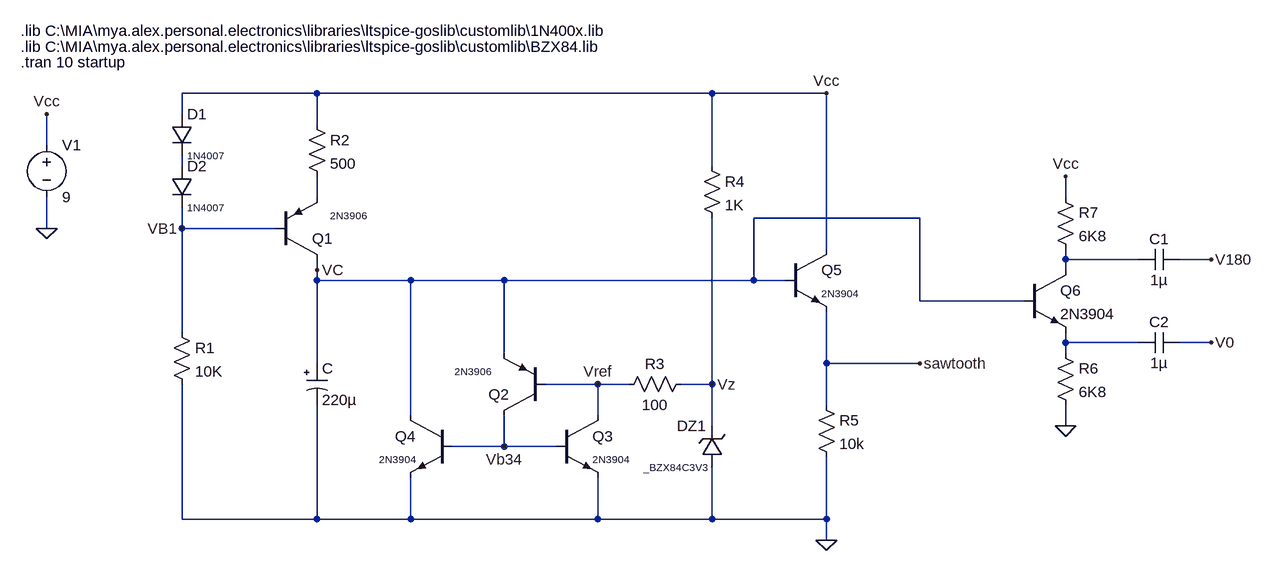
[diagram p0: schematic bjt-sawtooth-wave-generator.asc]
bjt-sawtooth-wave-generator.asc, the LTspice schematic file:
Version 4
SHEET 1 1076 740
WIRE -1648 -64 -1856 -64
WIRE -1040 -64 -1648 -64
WIRE -864 -64 -1040 -64
WIRE -1856 -32 -1856 -64
WIRE -1648 -16 -1648 -64
WIRE -2064 16 -2064 -32
WIRE -1856 48 -1856 32
WIRE -1040 48 -1040 -64
WIRE -1648 96 -1648 64
WIRE -496 96 -496 64
WIRE -720 128 -976 128
WIRE -2064 144 -2064 96
WIRE -1856 144 -1856 112
WIRE -1712 144 -1856 144
WIRE -864 176 -864 -64
WIRE -496 192 -496 176
WIRE -384 192 -496 192
WIRE -272 192 -320 192
WIRE -1648 208 -1648 192
WIRE -496 208 -496 192
WIRE -1648 224 -1648 208
WIRE -1504 224 -1648 224
WIRE -1360 224 -1504 224
WIRE -976 224 -976 128
WIRE -976 224 -1360 224
WIRE -928 224 -976 224
WIRE -720 256 -720 128
WIRE -560 256 -720 256
WIRE -1856 304 -1856 144
WIRE -496 320 -496 304
WIRE -384 320 -496 320
WIRE -272 320 -320 320
WIRE -1360 336 -1360 224
WIRE -496 336 -496 320
WIRE -1648 352 -1648 224
WIRE -864 352 -864 272
WIRE -720 352 -864 352
WIRE -1216 384 -1296 384
WIRE -1168 384 -1216 384
WIRE -1040 384 -1040 128
WIRE -1040 384 -1088 384
WIRE -864 416 -864 352
WIRE -1504 432 -1504 224
WIRE -1216 432 -1216 384
WIRE -1040 448 -1040 384
WIRE -496 448 -496 416
WIRE -1360 480 -1360 432
WIRE -1360 480 -1440 480
WIRE -1280 480 -1360 480
WIRE -1856 592 -1856 384
WIRE -1648 592 -1648 416
WIRE -1648 592 -1856 592
WIRE -1504 592 -1504 528
WIRE -1504 592 -1648 592
WIRE -1216 592 -1216 528
WIRE -1216 592 -1504 592
WIRE -1040 592 -1040 512
WIRE -1040 592 -1216 592
WIRE -864 592 -864 496
WIRE -864 592 -1040 592
WIRE -864 624 -864 592
FLAG -2064 144 0
FLAG -1856 144 VB1
FLAG -2064 -32 Vcc
FLAG -1648 208 VC
FLAG -1360 480 Vb34
FLAG -864 -64 Vcc
FLAG -864 624 0
FLAG -720 352 sawtooth
FLAG -1040 384 Vz
FLAG -1216 384 Vref
FLAG -496 448 0
FLAG -272 192 V180
FLAG -272 320 V0
FLAG -496 64 Vcc
SYMBOL voltage -2064 0 R0
WINDOW 123 0 0 Left 0
WINDOW 39 0 0 Left 0
SYMATTR InstName V1
SYMATTR Value 9
SYMBOL pnp -1712 192 M180
WINDOW 3 84 68 Left 1
SYMATTR Value 2N3906
SYMATTR InstName Q1
SYMBOL res -1664 -32 R0
SYMATTR InstName R2
SYMATTR Value 500
SYMBOL polcap -1664 352 R0
WINDOW 3 24 56 Left 2
SYMATTR Value 220µ
SYMATTR InstName C
SYMATTR Description Capacitor
SYMATTR Type cap
SYMBOL res -1872 288 R0
SYMATTR InstName R1
SYMATTR Value 10K
SYMBOL diode -1872 48 R0
WINDOW 3 24 64 Left 1
SYMATTR Value 1N4007
SYMATTR InstName D2
SYMBOL diode -1872 -32 R0
WINDOW 3 24 64 Left 1
SYMATTR Value 1N4007
SYMATTR InstName D1
SYMBOL zener -1024 512 R180
WINDOW 0 24 64 Left 2
WINDOW 3 24 0 Left 1
SYMATTR InstName DZ1
SYMATTR Value _BZX84C3V3
SYMBOL res -1056 32 R0
SYMATTR InstName R4
SYMATTR Value 1K
SYMBOL npn -1280 432 R0
WINDOW 3 56 68 Left 1
SYMATTR Value 2N3904
SYMATTR InstName Q3
SYMBOL pnp -1296 432 R180
WINDOW 3 84 68 Left 1
SYMATTR Value 2N3906
SYMATTR InstName Q2
SYMBOL npn -1440 432 M0
WINDOW 3 56 68 Left 1
SYMATTR Value 2N3904
SYMATTR InstName Q4
SYMBOL res -1072 368 R90
WINDOW 0 0 56 VBottom 2
WINDOW 3 32 56 VTop 2
SYMATTR InstName R3
SYMATTR Value 100
SYMBOL res -880 400 R0
SYMATTR InstName R5
SYMATTR Value 10k
SYMBOL npn -928 176 R0
WINDOW 3 56 68 Left 1
SYMATTR Value 2N3904
SYMATTR InstName Q5
SYMBOL npn -560 208 R0
SYMATTR InstName Q6
SYMATTR Value 2N3904
SYMBOL res -512 320 R0
SYMATTR InstName R6
SYMATTR Value 6K8
SYMBOL res -512 80 R0
SYMATTR InstName R7
SYMATTR Value 6K8
SYMBOL cap -320 176 R90
WINDOW 0 0 32 VBottom 2
WINDOW 3 32 32 VTop 2
SYMATTR InstName C1
SYMATTR Value 1µ
SYMBOL cap -320 304 R90
WINDOW 0 0 32 VBottom 2
WINDOW 3 32 32 VTop 2
SYMATTR InstName C2
SYMATTR Value 1µ
TEXT -2104 -112 Left 2 !.tran 10 startup
TEXT -2104 -160 Left 2 !.lib C:\\MIA\\mya.alex.personal.electronics\\libraries\\ltspice-goslib\\customlib\\1N400x.lib
TEXT -2104 -136 Left 2 !.lib C:\\MIA\\mya.alex.personal.electronics\\libraries\\ltspice-goslib\\customlib\\BZX84.lib

The netlist it stands for:
* bjt-sawtooth-wave-generator.asc
V1 Vcc 0 9
Q1 VC VB1 N002 0 2N3906
R2 Vcc N002 500
C VC 0 220µ
R1 VB1 0 10K
D2 N001 VB1 1N4007
D1 Vcc N001 1N4007
DZ1 0 Vz _BZX84C3V3
R4 Vcc Vz 1K
Q3 Vref Vb34 0 0 2N3904
Q2 Vb34 Vref VC 0 2N3906
Q4 VC Vb34 0 0 2N3904
R3 Vz Vref 100
R5 sawtooth 0 10k
Q5 Vcc VC sawtooth 0 2N3904
Q6 N003 VC N004 0 2N3904
R6 N004 0 6K8
R7 Vcc N003 6K8
C1 V180 N003 1µ
C2 V0 N004 1µ
.model D D
.lib standard.dio
.model NPN NPN
.model PNP PNP
.lib standard.bjt
.tran 10 startup
.lib C:\MIA\mya.alex.personal.electronics\libraries\ltspice-goslib\customlib\1N400x.lib
.lib C:\MIA\mya.alex.personal.electronics\libraries\ltspice-goslib\customlib\BZX84.lib
.backanno
.end